# EasyEDA Pro project CH32V307_V1.0.0.eprj, board CH32V307
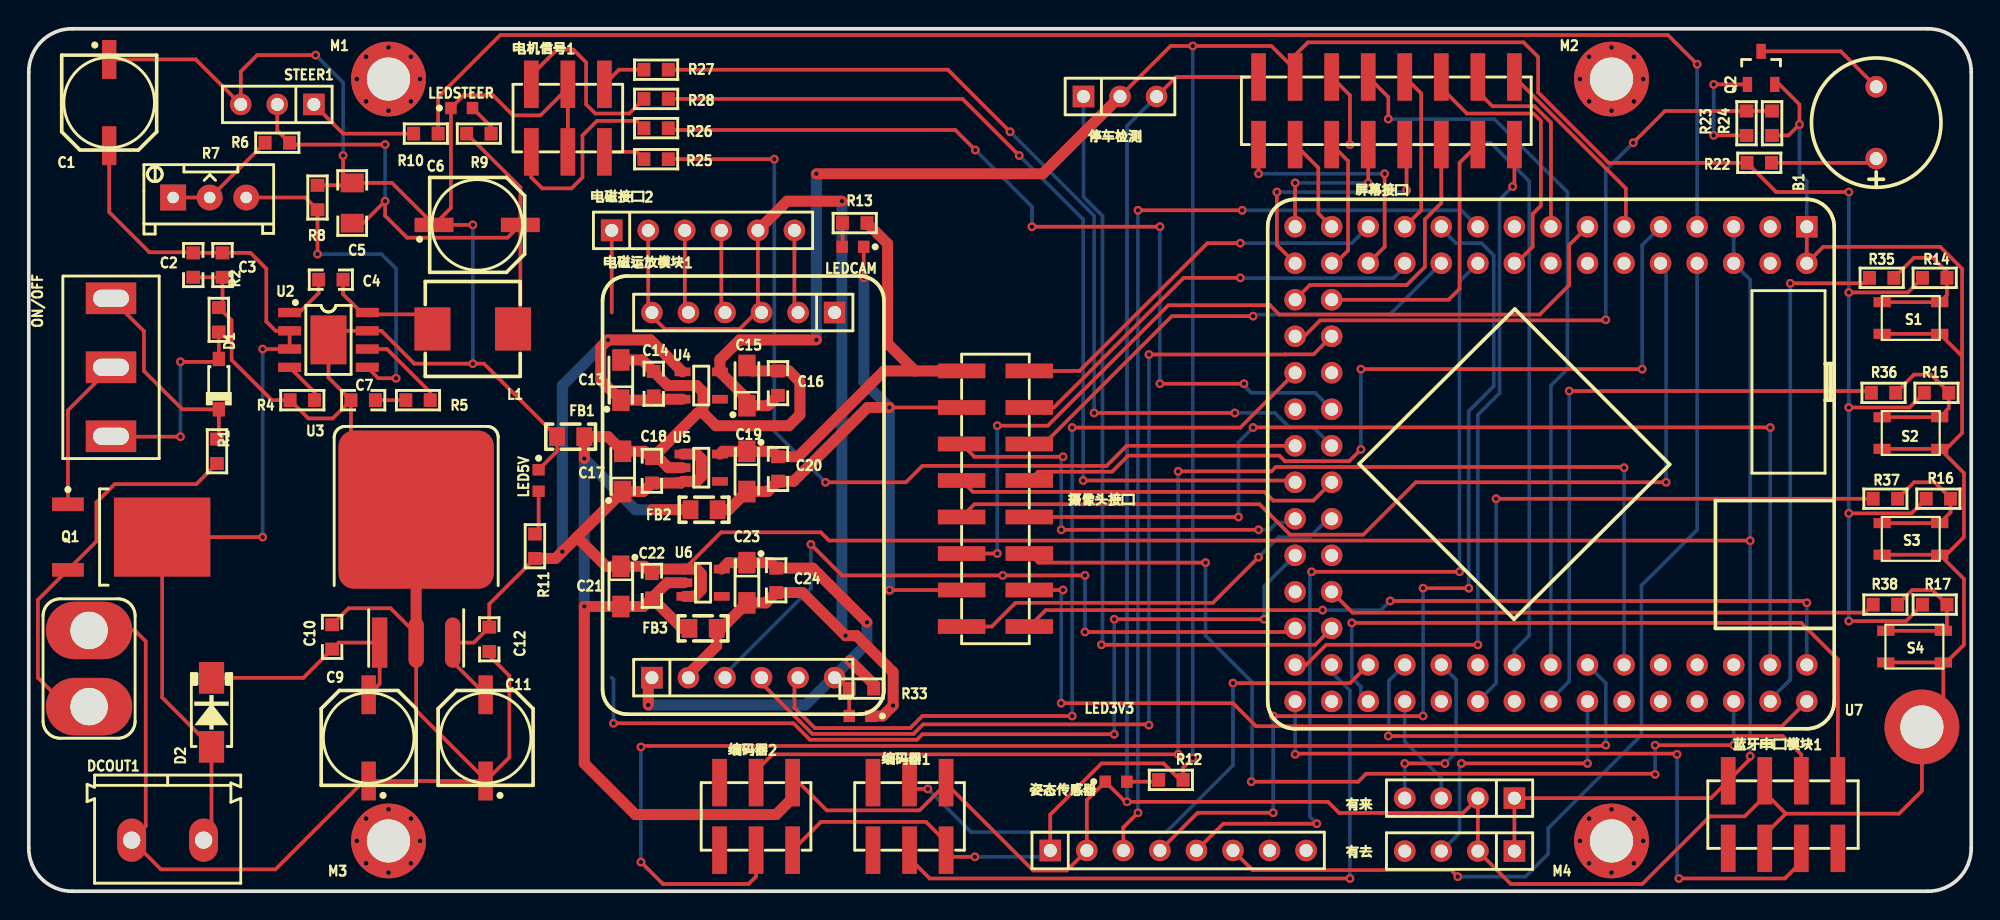
[diagram p1: board, top side]
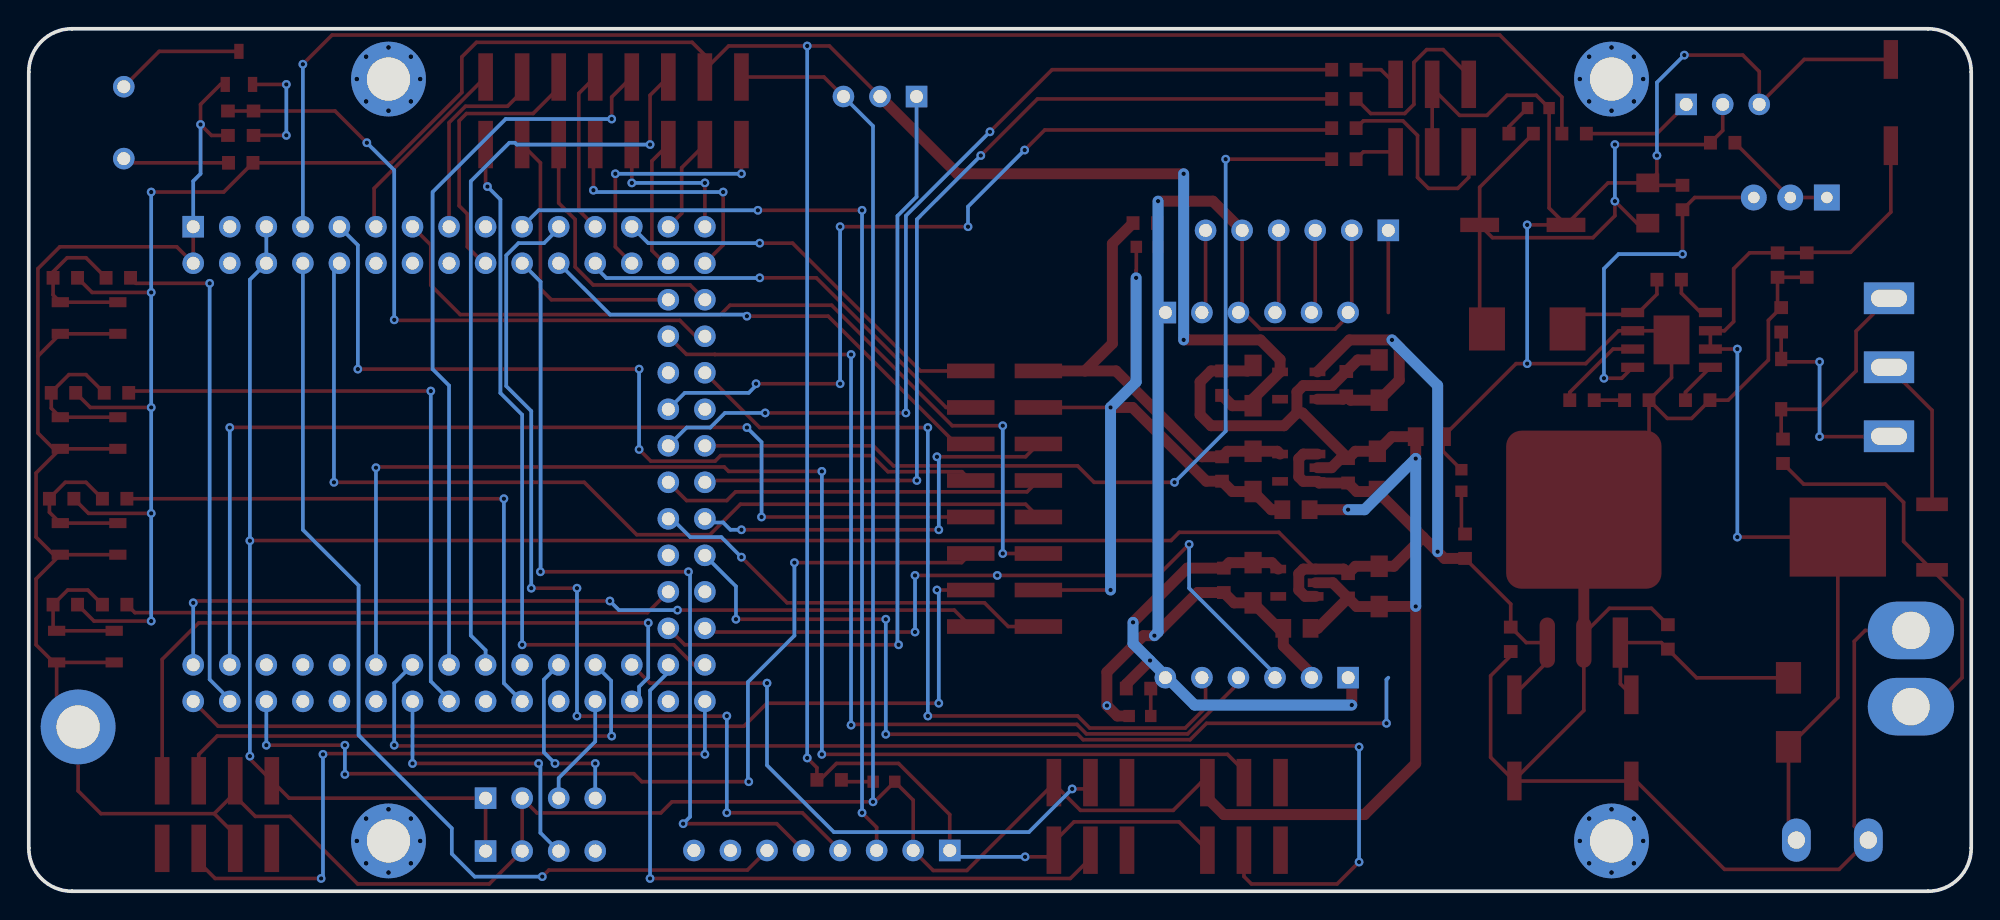
[diagram p2: board, bottom side, seen from below]

Outline 135 x 60 mm; copper layers: Top Layer, Bottom Layer. Coordinates in mm from the lower left corner of the outline.
Outline path: 0,57 0,3 arc(0.88,0.88) 3,0 132,0 arc(134.12,0.88) 135,3 135,57 arc(134.12,59.12) 132,60 3,60 arc(0.88,59.12) 0,57
Stack: Top Layer 0.035mm / Dielectric1 1.51mm FR4 er 4.5 / Bottom Layer 0.035mm

## Design rules (mm)
spacing safeClearance (default): track to track 0.152, other pairs 0.152 to 0.3
track width trackWidth (default): min 0.127, default 0.254, max 2.54
differential pair differentialPair (default): width min 0.127, default 0.254, max 2.54; gap min 0.152, default 0.152
via viaSize (default): diameter min 0.5, default 0.61, max 10; hole min 0.3, default 0.305, max 6

## Placement (name value [footprint] x y rotation side)
B1  BEEP  [BEEP 9x5.5mm]  128.4 53.47 90 top
C1  220uF  [CAPS6.3]  5.59 54.86 90 top
C2  4.7nF  [CAPC1608[0603]S-N]  11.43 43.56 270 top
C3  100nF  [CAPC1608[0603]S-N]  13.46 43.56 270 top
C4  100nF  [CAPC1608[0603]S-N]  20.99 42.55 0 top
C5  47uF  [CAPC3216[1206]S]  22.48 47.88 90 top
C6  220uF  [CAPS6.3]  31.16 46.36 180 top
C7  4.7nF  [CAPC1608[0603]S-N]  23.24 34.16 180 top
C9  100uF  [CAPS6.3]  23.62 10.67 270 top
C10  100nF  [CAPC1608[0603]S-N]  21.08 17.69 90 top
C11  220uF  [CAPS6.3]  31.75 10.67 270 top
C12  100nF  [CAPC1608[0603]S-N]  32 17.53 270 top
C13  10uF  [CAPT3216]  41.15 35.56 90 top
C14  100nF  [CAPC1608[0603]S-N]  43.43 35.31 90 top
C15  10uF  [CAPT3216]  49.91 35.18 90 top
C16  100nF  [CAPC1608[0603]S-N]  52.07 35.34 90 top
C17  10uF  [CAPT3216]  41.28 29.21 90 top
C18  100nF  [CAPC1608[0603]S-N]  43.31 29.25 90 top
C19  10uF  [CAPT3216]  49.91 29.21 270 top
C20  100nF  [CAPC1608[0603]S-N]  52.07 29.38 270 top
C21  10uF  [CAPT3216]  41.15 21.21 270 top
C22  100nF  [CAPC1608[0603]S-N]  43.31 21.25 270 top
C23  10uF  [CAPT3216]  49.91 21.46 270 top
C24  100nF  [CAPC1608[0603]S-N]  51.94 21.63 270 top
D1  BZT52C16  [SOD-123-L]  13.21 35.28 270 top
D2  SS54  [SMA[DO-214AC]]  12.7 12.45 90 top
DCOUT1  KF/WJ/DG 30x connecter  [KF/WJ/DG 301-2p-5.0mm]  9.65 3.56 0 top
FB1  0R  [INDC2012[0805]S]  37.66 31.62 0 top
FB2  0R  [INDC2012[0805]S]  46.93 26.54 0 top
FB3  0R  [INDC2012[0805]S]  46.86 18.29 0 top
L1  4.7uH  [0630 TPC 7*7*3]  30.86 39.12 0 top
LED3V3  翠绿贴片LED  [LEDC1608(0603)]  75.56 7.62 0 top
LED5V  翠绿贴片LED  [LEDC1608(0603)]  35.43 28.58 270 top
LEDCAM  翠绿贴片LED  [LEDC1608(0603)]  57.28 44.83 180 top
LEDOP  翠绿贴片LED  [LEDC1608(0603)]  57.77 12.19 180 top
LEDSTEER  翠绿贴片LED  [LEDC1608(0603)]  30.09 54.48 0 top
M1  MountHole  [M3-MountHole-Plated]  25 56.5 0 top
M2  MountHole  [M3-MountHole-Plated]  110 56.5 0 top
M3  MountHole  [M3-MountHole-Plated]  25 3.5 0 top
M4  MountHole  [M3-MountHole-Plated]  110 3.5 0 top
NOREF  -  [Pad_e1205]  131.57 11.43 0 top
ON/OFF  SW-SPDT  [SS12D10]  5.72 36.45 270 top
Q1  HY19P03  [TO-252AA]  6 24.64 0 top
Q2  S8050  [SOT-23]  120.4 57.28 90 top
R1  4.7K  [RESC1608[0603]S-N]  13.08 30.61 90 top
R2  1K  [RESC1608[0603]S-N]  13.21 39.75 270 top
R4  200K  [RESC1608[0603]S-N]  19.01 34.16 180 top
R5  20K  [RESC1608[0603]S-N]  27.05 34.16 180 top
R6  15K  [RESC1608[0603]S-N]  17.27 52.07 180 top
R7  10K  [RESPOT3296]  12.57 48.26 0 top
R8  3.3K  [RESC1608[0603]S-N]  20.07 48.26 90 top
R9  10K  [RESC1608[0603]S-N]  31.28 52.7 180 top
R10  1K  [RESC1608[0603]S-N]  27.6 52.7 0 top
R11  4.7K  [RESC1608[0603]S-N]  35.18 24 90 top
R12  2.7K  [RESC1608[0603]S-N]  79.38 7.75 180 top
R13  2.7K  [RESC1608[0603]S-N]  57.4 46.48 180 top
R14  4.7K(DNP)  [RESC1608[0603]S-N]  132.46 42.67 0 top
R15  4.7K(DNP)  [RESC1608[0603]S-N]  132.59 34.67 0 top
R16  4.7K(DNP)  [RESC1608[0603]S-N]  132.72 27.3 0 top
R17  4.7K(DNP)  [RESC1608[0603]S-N]  132.46 19.94 0 top
R22  10R  [RESC1608[0603]S-N]  120.27 50.67 0 top
R23  4.7K  [RESC1608[0603]S-N]  119.38 53.43 270 top
R24  10K  [RESC1608[0603]S-N]  121.16 53.43 270 top
R25  100R  [RESC1608[0603]S-N]  43.6 50.93 0 top
R26  100R  [RESC1608[0603]S-N]  43.6 53.09 0 top
R27  100R  [RESC1608[0603]S-N]  43.6 57.15 0 top
R28  100R  [RESC1608[0603]S-N]  43.6 55.12 0 top
R33  2.7K  [RESC1608[0603]S-N]  57.87 14.1 180 top
R35  470R  [RESC1608[0603]S-N]  128.78 42.67 180 top
R36  470R  [RESC1608[0603]S-N]  128.91 34.67 180 top
R37  470R  [RESC1608[0603]S-N]  129.03 27.3 180 top
R38  470R  [RESC1608[0603]S-N]  129.03 19.94 180 top
S1  Button  [PTS810-3*4-CurvePin]  130.81 39.88 0 top
S2  Button  [PTS810-3*4-CurvePin]  130.81 31.88 0 top
S3  Button  [PTS810-3*4-CurvePin]  130.81 24.51 0 top
S4  Button  [PTS810-3*4-CurvePin]  131.06 17.02 0 top
STEER1  Header 3  [HDR1X3]  19.81 54.74 180 top
U1  T型插头  [Wired T-Header ThroughHole]  4.19 15.49 180 top
U2  SCT2450  [SOP-8E]  20.83 38.35 0 top
U3  SPX2940-5.0  [TO-263-3]  26.92 21.92 0 top
U4  RT9013-33  [SOT-23-5]  46.74 35.18 0 top
U5  RT9013-33  [SOT-23-5]  46.74 29.46 0 top
U6  RT9013-33  [SOT-23-5]  46.86 21.46 0 top
U7  -  [CH32V307VxT6_CoreBoard]  123.57 46.23 180 top
停车检测  Header 3  [HDR1X3]  73.3 55.29 0 top
姿态传感器  Header 8  [HDR1X8]  70.99 2.84 0 top
屏幕接口  Header 8X2  [HDR2X8-M-SMT]  94.36 54.29 0 top
摄像头接口  Header 8X2  [HDR2X8-M-SMT]  67.18 27.3 90 top
有去  Header 4  [HDR1X4]  103.25 2.79 180 top
有来  Header 4  [HDR1X4]  103.25 6.48 180 top
电机信号1  Header 3X2  [HDR2X3-M-SMT]  37.47 53.78 0 top
电磁接口2  Header 6  [HDR1X6]  40.51 45.97 0 top
电磁运放模块1  OPA_MOD  [SEEKFREE_4CHANEL_OPAMOD]  49.66 27.56 0 top
编码器1  Header 3X2  [HDR2X3-M-SMT]  61.21 5.21 180 top
编码器2  Header 3X2  [HDR2X3-M-SMT]  50.55 5.21 180 top
蓝牙串口模块1  Header 4X2  [Female-Header-2.54-SMD-8]  121.92 5.33 270 top

## Footprints (pads in the part's own frame, mm; a bottom-side part is the same pattern mirrored in y, then rotated)
0630 TPC 7*7*3
  rect 2.5x3 smd: 1(-2.8,0) 2(2.8,0)
BEEP 9x5.5mm
  round 1.5 hole 0.9: 1(-2.5,0) 2(2.5,0)
CAPC1608[0603]S-N
  rect 0.9x0.95 smd: 1(-0.85,0) 2(0.85,0)
CAPC3216[1206]S
  rect 1.3x1.6 smd: 1(-1.4,0) 2(1.4,0)
CAPS6.3
  rect 2.7x1 smd: 1(-3,0) 2(3,0)
CAPT3216
  rect 1.5x1.2 smd: 1(-1.4,0) 2(1.4,0)
CH32V307VxT6_CoreBoard
  rect 1.5x1.5 hole 0.9: 1(0,0)
  round 1.5 hole 0.9: 2(0,2.54) 3(2.54,0) 4(2.54,2.54) 5(5.08,0) 6(5.08,2.54) 7(7.62,0) 8(7.62,2.54) 9(10.16,0) 10(10.16,2.54) 11(12.7,0) 12(12.7,2.54) 13(15.24,0) 14(15.24,2.54) 15(17.78,0) 16(17.78,2.54) 17(20.32,0) 18(20.32,2.54) 19(22.86,0) 20(22.86,2.54) 21(25.4,0) 22(25.4,2.54) 23(27.94,0) 24(27.94,2.54) 25(30.48,0) 26(30.48,2.54) 27(33.02,0) 28(33.02,2.54) 29(35.56,0) 30(35.56,2.54) 31(35.56,5.08) 32(33.02,5.08) 33(35.56,7.62) 34(33.02,7.62) 35(35.56,10.16) 36(33.02,10.16) 37(35.56,12.7) 38(33.02,12.7) 39(35.56,15.24) 40(33.02,15.24) 41(35.56,17.78) 42(33.02,17.78) 43(35.56,20.32) 44(33.02,20.32) 45(35.56,22.86) 46(33.02,22.86) 47(35.56,25.4) 48(33.02,25.4) 49(35.56,27.94) 50(33.02,27.94) 51(35.56,33.02) 52(35.56,30.48) 53(33.02,33.02) 54(33.02,30.48) 55(30.48,33.02) 56(30.48,30.48) 57(27.94,33.02) 58(27.94,30.48) 59(25.4,33.02) 60(25.4,30.48) 61(22.86,33.02) 62(22.86,30.48) 63(20.32,33.02) 64(20.32,30.48) 65(17.78,33.02) 66(17.78,30.48) 67(15.24,33.02) 68(15.24,30.48) 69(12.7,33.02) 70(12.7,30.48) 71(10.16,33.02) 72(10.16,30.48) 73(7.62,33.02) 74(7.62,30.48) 75(5.08,33.02) 76(5.08,30.48) 77(2.54,33.02) 78(2.54,30.48) 79(0,33.02) 80(0,30.48)
Female-Header-2.54-SMD-8
  rect 3.3x1.02 smd: 1(-2.35,3.81) 2(2.35,3.81) 3(-2.35,1.27) 4(2.35,1.27) 5(-2.35,-1.27) 6(2.35,-1.27) 7(-2.35,-3.81) 8(2.35,-3.81)
HDR1X3
  rect 1.5x1.5 hole 0.9: 1(0,0)
  round 1.5 hole 0.9: 2(2.54,0) 3(5.08,0)
HDR1X4
  rect 1.5x1.5 hole 0.9: 1(0,0)
  round 1.5 hole 0.9: 2(2.54,0) 3(5.08,0) 4(7.62,0)
HDR1X6
  rect 1.5x1.5 hole 0.9: 1(0,0)
  round 1.5 hole 0.9: 2(2.54,0) 3(5.08,0) 4(7.62,0) 5(10.16,0) 6(12.7,0)
HDR1X8
  rect 1.5x1.5 hole 0.9: 1(0,0)
  round 1.5 hole 0.9: 2(2.54,0) 3(5.08,0) 4(7.62,0) 5(10.16,0) 6(12.7,0) 7(15.24,0) 8(17.78,0)
HDR2X3-M-SMT
  rect 1.02x3.3 smd: 1(-2.54,-2.35) 2(-2.54,2.35) 3(0,-2.35) 4(0,2.35) 5(2.54,-2.35) 6(2.54,2.35)
HDR2X8-M-SMT
  rect 1.02x3.3 smd: 1(-8.89,-2.35) 2(-8.89,2.35) 3(-6.35,-2.35) 4(-6.35,2.35) 5(-3.81,-2.35) 6(-3.81,2.35) 7(-1.27,-2.35) 8(-1.27,2.35) 9(1.27,-2.35) 10(1.27,2.35) 11(3.81,-2.35) 12(3.81,2.35) 13(6.35,-2.35) 14(6.35,2.35) 15(8.89,-2.35) 16(8.89,2.35)
INDC2012[0805]S
  rect 1.1x1.3 smd: 1(-0.948,0) 2(0.948,0)
KF/WJ/DG 301-2p-5.0mm
  oval 2x3 hole 1.2: 1(2.5,0) 2(-2.5,0)
LEDC1608(0603)
  rect 0.8x0.85 smd: A(0.75,0) C(-0.75,0)
M3-MountHole-Plated
  round 5.2 hole 3: 1(0,0)
Pad_e1205
  round 5.2 hole 3: 1(0,0)
PTS810-3*4-CurvePin
  rect 1.2x0.7 smd: 1(-2,-1.1) 1(2,-1.1) 2(-2,1.1) 2(2,1.1)
RESC1608[0603]S-N
  rect 0.9x0.95 smd: 1(-0.85,0) 2(0.85,0)
RESPOT3296
  rect 1.8x1.8 hole 0.8: 1(-2.54,0)
  round 1.8 hole 0.8: 2(2.54,0) ADJ(0,0)
SEEKFREE_4CHANEL_OPAMOD
  rect 1.5x1.5 hole 0.9: 1(6.35,12.7) 7(-6.35,-12.7)
  round 1.5 hole 0.9: 2(3.81,12.7) 3(1.27,12.7) 4(-1.27,12.7) 5(-3.81,12.7) 6(-6.35,12.7) 8(-3.81,-12.7) 9(-1.27,-12.7) 10(1.27,-12.7) 11(3.81,-12.7) 12(6.35,-12.7)
SMA[DO-214AC]
  rect 2.2x1.75 smd: A(-2.4,0) K(2.4,0)
SOD-123-L
  rect 1x0.85 smd: A(-1.75,0) K(1.75,0)
SOP-8E
  rect 2.5x3.4 smd: 0(0,0)
  rect 1.6x0.65 smd: 1(-2.7,1.905) 2(-2.7,0.635) 3(-2.7,-0.635) 4(-2.7,-1.905) 5(2.7,-1.905) 6(2.7,-0.635) 7(2.7,0.635) 8(2.7,1.905)
SOT-23
  rect 1.05x0.65 smd: 1(-1.15,0.95) 2(-1.15,-0.95) 3(1.15,0)
SOT-23-5
  rect 1.1x0.6 smd: 1(-1.3,0.95) 2(-1.3,0) 3(-1.3,-0.95) 4(1.3,-0.95) 5(1.3,0.95)
SS12D10
  rect 2.2x3.5 hole 1.2x2.5: 1(-4.8,0) 2(0,0) 3(4.8,0)
TO-252AA
  rect 6.7x5.5 smd: 1(3.275,0)
  rect 2.2x0.95 smd: 2(-3.275,2.28) 3(-3.275,-2.28)
TO-263-3
  rect 1.07x3.5 smd: 1(-2.54,-4.623)
  rrect 10.8x11 smd: 2(0,4.623)
  rrect 1.07x3.5 smd: 2(0,-4.623) 3(2.54,-4.623)
Wired T-Header ThroughHole
  rrect 6x4 hole 2.6: 1(0,2.65) 2(0,-2.65)

## Nets
As in the schematic, except:
GND5V: C13.2 C14.2 C15.2 C16.2 C17.2 C18.2 C21.2 C22.2 FB1.2 FB2.1 FB3.1 LED3V3.C NOREF.1 Q2.2 R24.2 S1.1 S2.1 S3.1 S4.1 U4.2 U5.2 U6.2 U7.1 U7.2 停车检测.3 姿态传感器.2 屏幕接口.2 有去.2 有来.2 编码器1.1 编码器2.1 蓝牙串口模块1.5 蓝牙串口模块1.6

Pads without a net: M1 1; M2 1; M3 1; M4 1; U4 4; U5 4; U6 4; U7 3 4 12 14 16 17 36 37 46 47 53 59 62 63 69 71 72 73 74 76; 姿态传感器 7 8; 有去 4; 编码器1 5 6; 编码器2 5 6; 蓝牙串口模块1 2 8

## Via types
v1: diameter 0.61, hole 0.305, Top Layer to Bottom Layer, 203 vias

## Routing (per net, layer and track width the routed paths; a pad name or vN(x,y) marks a point on that pad's centre or on a via; arc(x,y) is an arc through that point)
GND5V: length 340.2
  Top Layer w0.254: S4.1 133.06,12.92 NOREF.1 131.57,6.98 129.98,5.4 122.11,5.4 ; S4.1 S4.1 ; S4.1 133.27,15.92 134.49,17.14 134.49,21.73 S3.1 ; 120.65,6.86 120.65,6.6 119.25,5.21 116.84,5.21 112.14,0.51 103,0.51 有去.2 有来.2 99.68,5.45 91.07,5.45 90.3,6.22 v1(76.33,6.22) 76.21,6.22 LED3V3.C 73.53,6.34 姿态传感器.2 72.14,1.44 69.8,1.44 63.75,7.49 ; 120.65,6.86 122.11,5.4 ; 120.65,6.86 蓝牙串口模块1.5 ; 63.75,7.49 63.75,7.47 61.91,5.63 55.46,5.63 53.53,7.56 编码器2.1 ; 63.75,7.49 编码器1.1 ; 停车检测.3 79.74,56.64 屏幕接口.2 ; S3.1 S3.1 ; S3.1 133.27,23.41 134.49,24.64 134.49,29.09 S2.1 ; 122.11,5.4 120.65,3.94 蓝牙串口模块1.6 ; S2.1 133.27,30.78 134.37,31.88 134.37,37.22 ; S2.1 S2.1 ; S1.1 S1.1 134.37,37.22 ; R24.2 122.3,52.58 v1(123.06,53.34) 123.06,54.74 121.67,56.13 Q2.2 ; 134.37,37.22 134.37,43.31 132.84,44.83 124.71,44.83 U7.2 U7.1
  Top Layer w0.762: 46.86,33.27 47.75,32.39 52.83,32.39 53.59,33.15 53.59,35.43 52.83,36.19 C16.2 50.29,36.19 49.91,36.58 ; 46.86,33.27 46.48,33.27 C18.2 ; 46.86,33.27 46.86,34.73 46.42,35.18 U4.2 44.41,35.18 C14.2 42.63,36.96 41.15,36.96 ; U5.2 44.45,29.46 43.82,30.1 C18.2 ; C18.2 42.8,30.61 C17.2 40.26,31.62 FB1.2 v1(38.61,30.1) ; v1(43.31,26.54) FB2.1 ; C22.2 44.37,21.46 U6.2 ; C22.2 45.42,18.29 FB3.1 ; C22.2 42.72,19.81 C21.2 41.14,19.81 v1(38.61,19.81) 38.61,8.89 42.16,5.33 51.94,5.33 53.09,6.48 编码器2.1
  Bottom Layer w0.254: U7.1 123.57,49.4 123.06,49.91 v1(123.06,53.34) ; v1(76.33,6.22) 76.33,53.23 停车检测.3
  Bottom Layer w0.762: v1(38.61,19.81) v1(38.61,30.1) 42.16,26.54 v1(43.31,26.54)
GNDBAT: length 213
  Top Layer w0.254: U3.2 26.92,12.57 31.75,7.75 C11.2 ; v1(21.84,51.18) 21.84,49.91 22.48,49.28 ; U3.2 22.39,31.08 C7.2 ; C7.2 21.12,32.89 19.43,32.89 R4.2 16.89,34.16 14.1,36.96 14.1,39.71 R2.1 13.46,40.86 C3.2 C2.2 ; C7.2 20.83,35.73 U2.0 21.46,38.99 U2.7 24.51,38.99 26.79,36.7 v1(30.86,36.7) 31.63,36.7 FB1.1 36.71,30.61 LED5V.C ; R8.2 22.31,49.11 22.48,49.28 ; U1.2 7.37,18.14 8.13,17.39 8.13,4.53 DCOUT1.2 9.18,1.52 17.14,1.52 23.29,7.67 C9.2 C11.2 ; 37.47,55.88 电机信号1.4 ; 37.47,55.88 35.56,53.97 33.66,53.97 32.26,55.37 30.23,55.37 LEDSTEER.C 29.34,47.53 C6.2 ; 37.47,55.88 电机信号1.3 ; 26.92,17.91 25.15,19.69 22.22,19.69 21.08,18.54 ; 22.48,49.28 25.24,49.28 C6.2 ; v1(19.94,58.17) 15.88,58.17 14.73,57.02 STEER1.3 11.61,57.86 C1.2 ; C11.2 33.4,9.32 33.4,14.99 32,16.38 C12.2 ; v1(30.86,46.36) C6.2
  Top Layer w0.762: U3.2 U3.2
  Bottom Layer w0.254: v1(19.94,58.17) 21.84,56.26 v1(21.84,51.18) ; v1(30.86,36.7) v1(30.86,46.36)
GNDCAM: length 49.5
  Top Layer w0.254: v1(59.82,20.95) 摄像头接口.4 ; v1(59.82,33.66) 摄像头接口.14 ; v1(58.04,42.67) 58.04,43.18 58.03,43.19 LEDCAM.C
  Top Layer w0.762: v1(59.82,33.66) 58.29,33.66 53.16,28.53 C20.2 51.35,27.81 C19.2 48.65,26.54 FB2.2
  Bottom Layer w0.762: v1(59.82,20.95) v1(59.82,33.66) 58.04,35.43 v1(58.04,42.67)
GNDOP: length 81.1
  Top Layer w0.254: 电磁接口2.5 50.67,40.26 50.55,40.26 49.4,39.12 44.2,39.12 43.05,40.26 电磁接口2.2
  Top Layer w0.762: 电磁接口2.5 52.71,48.01 v1(56.51,48.01) ; LEDOP.C 59.35,12.19 v1(60.07,12.92) 60.07,15.24 57.53,17.78 v1(56.77,17.78) 53.77,20.78 C24.2 51.22,20.06 C23.2 48.14,18.29 FB3.2 47.81,17.08 45.59,14.86
  Bottom Layer w0.762: v1(56.77,17.78) 56.51,18.03 v1(56.51,48.01)
VCC3V3: length 246.7
  Top Layer w0.254: v1(126.49,48.64) 121.45,48.64 R22.1 109.8,50.67 104.9,55.57 104.9,58.04 103.89,59.05 88.9,59.05 88.01,58.17 88.01,57.15 ; v1(126.49,33.66) 130.72,33.66 R15.1 ; v1(126.49,41.66) 130.59,41.66 131.61,42.67 ; 88.01,57.15 屏幕接口.4 ; 88.01,57.15 86.36,58.8 v1(80.9,58.8) 79.36,58.8 75.84,55.29 ; v1(80.9,9.27) 80.22,8.6 R12.1 80.01,7.75 78.87,8.89 74.55,8.89 70.99,5.33 姿态传感器.1 ; 131.61,19.94 130.47,18.8 v1(126.49,18.8) ; R16.1 130.85,26.29 v1(126.49,26.29) ; 编码器2.2 55.06,4.83 62.36,4.83 63.75,3.43 编码器1.2 64.22,2.4 v1(65.76,2.4)
  Top Layer w0.762: 75.84,55.29 70.47,49.91 v1(54.74,49.91) ; v1(54.74,38.35) 49.4,38.35 48.04,36.99 U4.5 49.91,34.25 C15.1 51.35,33.78 C16.1
  Bottom Layer w0.254: 姿态传感器.1 70.55,2.4 v1(65.76,2.4) ; v1(80.9,58.8) v1(80.9,9.27) ; v1(126.49,18.8) v1(126.49,33.66) v1(126.49,41.66) v1(126.49,48.64)
  Bottom Layer w0.762: v1(54.74,49.91) v1(54.74,38.35)
VCC5V: length 208.5
  Top Layer w0.254: C11.1 29.46,15.95 U3.3 30.92,17.3 C12.1 32,19.98 R11.1 ; v1(119.63,24.38) 119.62,24.4 55.61,24.4 55.04,24.97 48.12,24.97 U6.1 ; v1(119.63,9.4) 119.63,9.21 蓝牙串口模块1.7 116.9,6.48 有来.1 有去.1
  Top Layer w0.762: 37.04,23.58 36.61,23.15 R11.1 ; 37.04,23.58 v1(37.08,23.62) ; 37.04,23.58 38.1,24.63 ; U4.1 43.21,38.35 v1(40.26,38.35) 39.75,37.85 39.75,35.56 C13.1 43.14,34.16 C14.1 43.66,34.23 U4.3 ; U5.1 46.42,30.41 46.74,30.1 46.74,28.83 46.42,28.51 U5.3 45.32,28.4 C18.1 42.72,27.81 C17.1 38.1,24.63 ; 38.1,24.63 40.13,22.61 C21.1 42.8,22.61 C22.1 43.62,22.41 U6.1 46.42,22.41 46.74,22.09 46.74,20.95 46.29,20.51 U6.3
  Bottom Layer w0.254: v1(119.63,9.4) v1(119.63,24.38) 119.63,42.55 U7.6 U7.5
  Bottom Layer w0.762: v1(37.08,23.62) 37.08,35.18 v1(40.26,38.35)
VCCBAT: length 68.7
  Top Layer w0.254: v1(16.26,37.72) U2.3 U2.2 17.15,38.99 16.51,39.63 16.51,43.31 15.41,44.41 C3.1 C2.1 11.39,44.45 8.38,44.45 5.59,47.24 C1.1 ; v1(16.26,24.64) Q1.1 9.27,13.47 D2.A 12.7,4.1 DCOUT1.1
  Bottom Layer w0.254: v1(16.26,37.72) v1(16.26,24.64)
VCCCAM: length 31.2
  Top Layer w0.762: 61.59,36.19 59.44,36.19 53.47,30.23 C20.1 51.69,30.61 C19.1 48.23,30.61 U5.5 ; 61.59,36.19 59.69,38.1 59.69,45.05 R13.1 ; 61.59,36.19 摄像头接口.16
VCCOP: length 35
  Top Layer w0.762: R33.1 58.72,14.4 v1(57.07,16.05) ; U6.5 48.61,22.86 C23.1 51.56,22.86 C24.1 54.48,22.48 v1(58.25,18.71) ; 43.05,14.86 v1(43.05,12.95)
  Bottom Layer w0.762: v1(58.25,18.71) 58.25,17.23 v1(57.07,16.05) 53.97,12.95 v1(43.05,12.95)
VCCSTEER: length 43.3
  Top Layer w0.254: C5.1 23.23,46.48 v1(24.77,48.01) 24.77,46.99 26.29,45.47 33.27,45.47 C6.1 ; C6.1 34.16,39.62 L1.2 ; C6.1 34.16,48.97 30.43,52.7 ; STEER1.2 17.27,52.92 R6.1 18.25,51.94 v1(24.77,51.94)
  Bottom Layer w0.254: v1(24.77,51.94) v1(24.77,48.01)
(no net):
  vias: v1(22.8,56.5) v1(22.8,56.5) v1(22.8,3.5) v1(22.8,3.5) v1(23.44,58.06) v1(23.44,58.06) v1(23.44,54.94) v1(23.44,54.94) v1(23.44,5.06) v1(23.44,5.06) v1(23.44,1.94) v1(23.44,1.94) v1(25,58.7) v1(25,58.7) v1(25,54.3) v1(25,54.3) v1(25,5.7) v1(25,5.7) v1(25,1.3) v1(25,1.3) v1(26.56,58.06) v1(26.56,58.06) v1(26.56,54.94) v1(26.56,54.94) v1(26.56,5.06) v1(26.56,5.06) v1(26.56,1.94) v1(26.56,1.94) v1(27.2,56.5) v1(27.2,56.5) v1(27.2,3.5) v1(27.2,3.5) v1(107.8,56.5) v1(107.8,56.5) v1(107.8,3.5) v1(107.8,3.5) v1(108.44,58.06) v1(108.44,58.06) v1(108.44,54.94) v1(108.44,54.94) v1(108.44,5.06) v1(108.44,5.06) v1(108.44,1.94) v1(108.44,1.94) v1(110,58.7) v1(110,58.7) v1(110,54.3) v1(110,54.3) v1(110,5.7) v1(110,5.7) v1(110,1.3) v1(110,1.3) v1(111.56,58.06) v1(111.56,58.06) v1(111.56,54.94) v1(111.56,54.94) v1(111.56,5.06) v1(111.56,5.06) v1(111.56,1.94) v1(111.56,1.94) v1(112.2,56.5) v1(112.2,56.5) v1(112.2,3.5) v1(112.2,3.5)
A0: length 61.5
  Top Layer w0.254: v1(65.79,51.56) 64.39,52.96 44.58,52.96 R26.2 ; v1(69.72,46.23) v1(78.61,46.23) ; v1(78.61,35.31) v1(84.46,35.31)
  Bottom Layer w0.254: v1(65.79,51.56) 69.72,47.62 v1(69.72,46.23) ; U7.38 89.41,34.67 84.96,34.67 84.46,35.18 v1(84.46,35.31) ; v1(78.61,46.23) v1(78.61,35.31)
A1: length 65
  Top Layer w0.254: v1(51.82,50.93) R25.2 ; U7.39 76.3,30.99 74.91,29.59 62.1,29.59 60.96,28.45 v1(55.37,28.45)
  Bottom Layer w0.254: v1(51.82,50.93) 51.82,32 v1(55.37,28.45)
A2: length 65
  Top Layer w0.254: v1(83.82,33.27) v1(74.04,33.27) ; v1(68.2,52.83) 63.88,57.15 R27.2
  Bottom Layer w0.254: U7.40 89.28,32.26 87.63,32.26 86.61,33.27 v1(83.82,33.27) ; v1(68.2,52.83) 74.04,46.99 v1(74.04,33.27)
A3: length 65.2
  Top Layer w0.254: R28.2 64.9,55.12 v1(68.83,51.18) ; U7.41 87.88,28.58 v1(73.28,28.58)
  Bottom Layer w0.254: v1(73.28,28.58) 73.28,46.74 v1(68.83,51.18)
A4: length 26.8
  Top Layer w0.254: 摄像头接口.10 65.62,27.79 85.88,27.79 86.49,27.18 89.28,27.18 U7.42
A5: length 29.1
  Top Layer w0.254: v1(71.88,30.23) 65.72,30.23 摄像头接口.12 ; v1(85.47,25.15) v1(71.75,25.15)
  Bottom Layer w0.254: v1(71.75,25.15) 71.75,30.1 v1(71.88,30.23) ; U7.43 87.76,25.65 86.74,25.65 86.23,25.15 v1(85.47,25.15)
A6: length 28.8
  Top Layer w0.254: 摄像头接口.2 66.93,18.41 68.58,20.07 82.3,20.07 v1(85.47,23.24)
  Bottom Layer w0.254: U7.44 90.3,25.91 89.03,24.64 86.87,24.64 v1(85.47,23.24)
A7: length 62.4
  Top Layer w0.254: v1(85.85,18.92) v1(75.44,18.92) ; v1(75.44,10.92) 62.1,10.92 61.72,10.54 54.29,10.54 53.15,11.68 v1(40.64,11.68)
  Bottom Layer w0.254: v1(40.64,11.68) 40.64,14.73 40.51,14.86 ; v1(85.85,18.92) 85.85,21.21 U7.45 ; v1(75.44,18.92) v1(75.44,10.92)
A8: length 35.3
  Top Layer w0.254: R35.2 127.55,42.29 v1(122.43,42.29)
  Bottom Layer w0.254: U7.77 121.03,13.33 122.43,14.73 v1(122.43,42.29)
A9: length 59.1
  Top Layer w0.254: v1(89.92,19.56) 70.68,19.56 摄像头接口.1 ; v1(94.62,20.19) 123.44,20.19 v1(123.57,20.07)
  Bottom Layer w0.254: v1(89.92,19.56) 93.98,19.56 v1(94.62,20.19) ; v1(123.57,20.07) U7.80
A10: length 63.5
  Top Layer w0.254: v1(71.75,13.08) 83.69,13.08 85.29,11.48 121.84,11.48 U7.79 ; v1(71.88,20.95) 摄像头接口.3
  Bottom Layer w0.254: v1(71.88,20.95) 71.75,20.83 v1(71.75,13.08)
A15: length 104
  Top Layer w0.254: R10.2 28.45,55.25 32.77,59.56 113.92,59.56 v1(115.95,57.53)
  Bottom Layer w0.254: v1(115.95,57.53) U7.7
B0: length 38.5
  Top Layer w0.254: U7.48 92,19.38 127.62,19.38 R38.2
B1: length 50.4
  Top Layer w0.254: v1(54.36,24.13) 56.51,21.97 v1(67.69,21.97) v1(73.41,21.97) ; v1(73.41,18.03) 87.4,18.03 87.65,18.29 U7.49
  Bottom Layer w0.254: v1(54.36,24.13) 54.36,21.08 48.13,14.86 ; v1(73.41,18.03) v1(73.41,21.97)
B2: length 55.2
  Top Layer w0.254: U7.50 89.41,17.14 v1(74.55,17.14)
  Bottom Layer w0.254: 停车检测.1 73.3,48.3 74.62,46.98 74.62,17.22 v1(74.55,17.14)
B3: length 69.1
  Top Layer w0.254: v1(77.09,5.46) 76.07,4.44 姿态传感器.3 ; v1(77.09,47.37) v1(84.33,47.37)
  Bottom Layer w0.254: U7.19 99.57,47.37 v1(84.33,47.37) ; v1(77.09,47.37) v1(77.09,5.46)
B4: length 59.2
  Top Layer w0.254: v1(89.52,4.7) 83.02,4.7 姿态传感器.5 ; v1(89.15,22.22) v1(99.44,22.22)
  Bottom Layer w0.254: v1(99.44,22.22) 99.43,22.24 99.43,42.41 U7.20 ; v1(89.15,22.22) 89.04,22.11 89.04,5.18 v1(89.52,4.7)
B5: length 66.6
  Top Layer w0.254: 姿态传感器.4 81.24,5.46 v1(86.49,5.46) ; v1(96.9,21.08) v1(100.08,21.08) ; v1(86.49,12.19) 86.5,12.18 96.89,12.18 v1(96.9,12.19)
  Bottom Layer w0.254: v1(86.49,12.19) v1(86.49,5.46) ; U7.21 98.17,46.1 99.19,45.08 100.97,45.08 101.81,44.23 101.81,35.14 100.08,33.4 v1(100.08,21.08) ; v1(96.9,21.08) v1(96.9,12.19)
B6: length 33.8
  Top Layer w0.254: 摄像头接口.11 70.55,31.11 79.44,40 v1(85.09,40)
  Bottom Layer w0.254: U7.22 94.6,40.12 85.2,40.12 v1(85.09,40)
B7: length 11.4
  Top Layer w0.254: U7.23 96.77,47.37 96.77,55.5 屏幕接口.10
B8: length 30.4
  Top Layer w0.254: v1(84.2,42.67) 80.26,42.67 71.25,33.66 摄像头接口.13
  Bottom Layer w0.254: v1(84.2,42.67) 84.21,42.66 94.86,42.66 95.63,43.43 U7.24
B9: length 27.7
  Top Layer w0.254: 摄像头接口.15 73.03,36.19 81.91,45.08 v1(84.2,45.08)
  Bottom Layer w0.254: U7.25 91.95,45.08 v1(84.2,45.08)
B12: length 40.8
  Top Layer w0.254: v1(101.98,27.3) R37.2
  Bottom Layer w0.254: v1(101.98,27.3) 101.98,14.48 U7.61
B13: length 52.9
  Top Layer w0.254: v1(91.82,51.94) 91.82,55.37 屏幕接口.6
  Bottom Layer w0.254: U7.64 103.25,16.76 104.28,17.79 104.28,49.39 101.6,52.07 101.22,52.07 101.09,51.94 v1(91.82,51.94)
B15: length 51.4
  Top Layer w0.254: v1(94.49,53.72) 94.49,55.25 屏幕接口.8
  Bottom Layer w0.254: v1(94.49,53.72) 101.85,53.72 106.93,48.64 106.93,36.32 105.79,35.18 U7.66
C0: length 68.2
  Top Layer w0.254: v1(77.85,11.56) 77.8,11.61 62.15,11.61 61.49,10.95 54.46,10.95 50.67,14.73 50.67,14.86 ; U7.34 89.29,37.35 87.32,37.35 87.31,37.34 v1(77.85,37.34)
  Bottom Layer w0.254: v1(77.85,37.34) v1(77.85,11.56)
C1: length 59.5
  Top Layer w0.254: 53.21,14.86 53.21,12.77 54.63,11.35 61.26,11.35 62.1,12.19 v1(72.52,12.19) ; U7.35 84.2,32.26 v1(72.52,32.26)
  Bottom Layer w0.254: v1(72.52,12.19) v1(72.52,32.26)
C8: length 68
  Top Layer w0.254: v1(113.03,8.13) 112.98,8.18 92.95,8.18 92.39,7.62 v1(84.96,7.62) ; v1(81.79,22.86) 70.17,22.86 摄像头接口.5 ; v1(113.03,10.16) v1(118.49,10.16)
  Bottom Layer w0.254: v1(81.79,22.86) 81.79,17.78 85.02,14.55 85.02,7.63 85.01,7.62 v1(84.96,7.62) ; v1(113.03,10.16) v1(113.03,8.13) ; v1(118.49,10.16) U7.75
C9: length 73.6
  Top Layer w0.254: v1(85.09,32.26) 85.1,32.27 121.02,32.27 v1(121.03,32.26) ; v1(84.07,26.03) 摄像头接口.7
  Bottom Layer w0.254: v1(121.03,32.26) U7.78 ; v1(85.09,32.26) 84.07,31.24 v1(84.07,26.03)
C10: length 68.7
  Top Layer w0.254: v1(99.31,1.02) 98.86,1.47 85.06,1.47 83.69,2.84
  Bottom Layer w0.254: U7.8 115.95,25.15 112.08,21.27 112.08,10.86 105.6,4.38 105.6,2.6 104.01,1.02 v1(99.31,1.02)
C11: length 59.8
  Top Layer w0.254: 摄像头接口.9 70.14,29.18 75.29,29.18 76.4,30.3 86.92,30.3 87.3,29.92 91.77,29.92 v1(92.58,30.73) ; v1(92.58,36.32) v1(112.13,36.32)
  Bottom Layer w0.254: U7.9 112.13,44.95 v1(112.13,36.32) ; v1(92.58,30.73) v1(92.58,36.32)
C12: length 67.1
  Top Layer w0.254: 摄像头接口.8 65.72,26.92 85.54,26.92 87.66,24.8 92.75,24.8 96.39,28.45 v1(113.79,28.45)
  Bottom Layer w0.254: v1(113.79,28.45) 113.79,43.31 U7.10
C13: length 45.7
  Top Layer w0.254: U7.33 88.65,38.61 89.75,39.71 109.56,39.71 v1(109.6,39.75) ; R24.1 R23.1 113.71,54.28 v1(111.51,52.07)
  Bottom Layer w0.254: v1(111.51,52.07) 109.6,50.16 v1(109.6,39.75)
D0: length 13.7
  Top Layer w0.254: U7.11 111,46.36 111,48.9 屏幕接口.16
D2: length 60.3
  Top Layer w0.254: U7.13 107.06,44.96 107.06,42.16 105.02,40.12 86.91,40.12 86.27,40.77 79.2,40.77 70.82,32.39 v1(67.31,32.39) ; v1(67.31,23.5) 摄像头接口.6
  Bottom Layer w0.254: v1(67.31,32.39) v1(67.31,23.5)
D4: length 14.2
  Top Layer w0.254: 屏幕接口.14 100.71,55.63 101.73,54.61 104.65,54.61 105.79,53.47 U7.15
D7: length 19.4
  Top Layer w0.254: U7.18 103.38,43.69 104.52,44.83 104.52,47.12 105.09,47.69 105.09,53.59 104.58,54.1 99.95,54.1 98.17,55.88 屏幕接口.12
D8: length 43.2
  Top Layer w0.254: v1(107.06,34.8) 127.93,34.8 R36.2
  Bottom Layer w0.254: v1(107.06,34.8) 107.06,14.61 105.79,13.33 U7.65
D9: length 91.9
  Top Layer w0.254: v1(42.54,2.03) 44.07,0.51 50.03,0.51 50.55,1.03 编码器2.4 ; v1(109.6,10.16) 109.55,10.11 42.62,10.11 v1(42.54,10.03)
  Bottom Layer w0.254: v1(42.54,2.03) v1(42.54,10.03) ; v1(109.6,10.16) 109.6,14.48 U7.68
D10: length 19.8
  Top Layer w0.254: v1(99.57,8.89) v1(108.33,8.89)
  Bottom Layer w0.254: 有去.3 99.44,4.06 99.44,8.76 v1(99.57,8.89) ; v1(108.33,8.89) U7.67
D11: length 95.2
  Top Layer w0.254: 编码器2.3 50.55,8.38 51.69,9.53 v1(79.88,9.53) ; v1(79.88,29.21) 86.36,29.21 86.66,29.52 110.82,29.52 v1(110.87,29.46)
  Bottom Layer w0.254: v1(110.87,29.46) U7.70 ; v1(79.88,29.21) v1(79.88,9.53)
E0: length 17.5
  Top Layer w0.254: v1(85.47,49.91) 屏幕接口.1 ; v1(94.23,49.91) 94.23,44.83 U7.26
  Bottom Layer w0.254: v1(94.23,49.91) v1(85.47,49.91)
E1: length 6.8
  Top Layer w0.254: 屏幕接口.3 89.62,50.33 89.62,47.16 U7.27
E2: length 9.4
  Top Layer w0.254: 屏幕接口.5 91.69,50.8 91.69,44.58 90.81,43.69 U7.28
E3: length 10.8
  Top Layer w0.254: v1(88.01,49.28) U7.29 ; v1(93.09,49.28) 屏幕接口.7
  Bottom Layer w0.254: v1(93.09,49.28) v1(88.01,49.28)
E4: length 17.8
  Top Layer w0.254: U7.30 86.74,44.96 v1(86.74,48.64) ; v1(95.76,48.77) 95.76,51.82 屏幕接口.9
  Bottom Layer w0.254: v1(86.74,48.64) 95.63,48.64 v1(95.76,48.77)
E5: length 18.9
  Top Layer w0.254: U7.31 89.04,42.18 95.77,42.18 97.03,43.43 97.03,46.74 98.17,47.88 屏幕接口.11
E6: length 19.8
  Top Layer w0.254: U7.32 98.68,41.15 99.44,41.91 99.44,50.67 屏幕接口.13
E7: length 49.1
  Top Layer w0.254: 屏幕接口.15 103.25,49.15 v1(103.12,49.02) ; U7.52 88.77,15.75 90.17,17.14 v1(100.71,17.14)
  Bottom Layer w0.254: v1(100.71,17.14) 100.71,33.15 102.22,34.66 102.22,48.12 v1(103.12,49.02)
E8: length 48.9
  Top Layer w0.254: v1(88.01,9.53) 88.06,9.58 114.5,9.58 v1(114.55,9.53) ; 蓝牙串口模块1.4 123.19,2.03 122.05,0.89 v1(114.68,0.89)
  Bottom Layer w0.254: v1(114.55,9.53) 114.55,1.02 v1(114.68,0.89) ; v1(88.01,9.53) U7.51
E9: length 47.1
  Top Layer w0.254: v1(91.82,0.89) 62.61,0.89 61.21,2.29 编码器1.4
  Bottom Layer w0.254: v1(91.82,0.89) 91.82,13.97 90.55,15.24 U7.54
E11: length 41.5
  Top Layer w0.254: v1(62.48,7.12) 61.65,7.12 编码器1.3 ; v1(83.69,14.48) 91.82,14.48 U7.56
  Bottom Layer w0.254: v1(83.69,14.48) 83.69,8.76 79.04,4.11 65.49,4.11 v1(62.48,7.12)
E12: length 49.5
  Top Layer w0.254: 蓝牙串口模块1.1 125.73,16.13 123.19,18.67 v1(91.95,18.67)
  Bottom Layer w0.254: U7.55 92.58,13.21 92.58,14.22 91.95,14.86 v1(91.95,18.67)
E13: length 36.5
  Top Layer w0.254: 蓝牙串口模块1.3 123.19,9.51 121.91,10.8 v1(94.49,10.8)
  Bottom Layer w0.254: v1(94.49,10.8) 94.53,10.83 94.53,14.64 U7.58
E14: length 7.8
  Bottom Layer w0.254: U7.57 95.63,10.41 98.17,7.87 有来.3
E15: length 12.8
  Top Layer w0.254: v1(98.43,8.89) v1(95.63,8.89)
  Bottom Layer w0.254: U7.60 99.2,14.72 99.2,9.67 v1(98.43,8.89) ; v1(95.63,8.89) 有来.4
$1N1646: length 27.8
  Top Layer w0.254: R1.1 11.64,28.32 5.97,28.32 4.7,27.05 4.7,24.34 0.64,20.27 0.64,14.86 2.65,12.84 U1.1
$1N1675: length 14.7
  Top Layer w0.254: ON/OFF.3 5.74,31.62 v1(10.54,31.62) ; v1(10.54,36.83) 13.01,36.83 D1.A R2.2
  Bottom Layer w0.254: v1(10.54,36.83) v1(10.54,31.62)
$1N1680: length 14.4
  Top Layer w0.254: R1.2 13.21,31.58 D1.K 10.67,33.53 8,36.19 8,38.96 ON/OFF.1
$1N4031: length 2.3
  Top Layer w0.254: R12.2 78.4,7.62 LED3V3.A
$1N14893: length 1.7
  Top Layer w0.254: LEDCAM.A 56.55,44.86 R13.2
$1N15943: length 16.6
  Top Layer w0.254: C9.1 24.38,14.43 U3.1 21.54,17.3 C10.1 19.09,14.85 D2.K
$1N17858: length 3.1
  Top Layer w0.254: R11.2 35.43,25.11 LED5V.A
$1N22991: length 1.9
  Top Layer w0.254: R33.2 LEDOP.A
$1N30175: length 10.8
  Top Layer w0.254: 2.72,26.92 2.72,33.45 ON/OFF.2
$1N38666: length 3
  Top Layer w0.254: 19.86,34.16 19.86,34.72 U2.4
$1N39173: length 3.5
  Top Layer w0.254: C4.1 20.14,41.61 18.8,40.26 U2.1
$1N39467: length 8.2
  Top Layer w0.254: L1.1 27.04,40.13 23.66,40.13 U2.8 23.11,40.26 21.84,41.53 C4.2
$1N41387: length 8
  Top Layer w0.254: R6.2 12.61,48.26 R7.ADJ 10.03,48.26
$1N41664: length 6.2
  Top Layer w0.254: R5.1 27.9,34.71 24.89,37.72 U2.6
$1N41948: length 2.1
  Top Layer w0.254: R5.2 C7.1
$1N42725: length 24.2
  Top Layer w0.254: U2.5 24.29,35.69 v1(25.53,35.69) ; R7.2 19.22,48.26 R8.1 v1(20.07,44.32)
  Bottom Layer w0.254: v1(20.07,44.32) 24.51,44.32 25.53,43.31 v1(25.53,35.69)
$1N43649: length 2.3
  Top Layer w0.254: R9.1 32.13,53.19 LEDSTEER.A
$1N45499: length 7.8
  Top Layer w0.254: STEER1.1 21.84,52.7 R10.1
$1N56324: length 11
  Top Layer w0.254: S1.2 S1.2 133.31,41.48 R14.2 133.31,43.09 132.33,44.07 131.03,44.07 R35.1
$1N56387: length 10.7
  Top Layer w0.254: S2.2 S2.2 133.44,33.61 R15.2 133.44,34.71 132.21,35.94 131.03,35.94 R36.1
$1N56450: length 10.7
  Top Layer w0.254: S3.2 S3.2 133.56,26.37 R16.2 133.56,27.34 132.46,28.45 131.03,28.45 R37.1
$1N56513: length 10.2
  Top Layer w0.254: R38.1 130.9,20.95 132.29,20.95 R17.2 133.31,18.36 S4.2 S4.2
$1N101481: length 7.4
  Top Layer w0.254: B1.1 128.1,50.67 R22.2
$1N101720: length 9
  Top Layer w0.254: B1.2 125.94,58.43 Q2.3
$1N102266: length 8.2
  Top Layer w0.254: R23.2 119.37,52.58 v1(117.1,52.58) ; Q2.1 v1(117.1,56.13)
  Bottom Layer w0.254: v1(117.1,56.13) v1(117.1,52.58) 117.09,52.58
$1N103802: length 3
  Top Layer w0.254: 电机信号1.5 42.24,51.44 R25.1
$1N103804: length 13.8
  Top Layer w0.254: 电机信号1.1 34.92,49.66 35.69,48.89 37.72,48.89 38.48,49.66 38.48,52.58 39.5,53.59 42.24,53.59 R26.1
$1N103886: length 3.2
  Top Layer w0.254: R27.1 41.02,57.15 电机信号1.6
$1N103888: length 13.2
  Top Layer w0.254: R28.1 41.73,54.1 39.37,54.1 38.73,54.74 38.73,57.66 37.85,58.55 36.7,58.55 34.92,56.77 电机信号1.2
$1N112323: length 5.7
  Top Layer w0.254: 53.21,40.26 电磁接口2.6
$1N112483: length 5.7
  Top Layer w0.254: 48.13,40.26 电磁接口2.4
$1N112563: length 5.7
  Top Layer w0.254: 45.59,40.26 电磁接口2.3
$1N112723: length 5.7
  Top Layer w0.254: 电磁接口2.1 40.51,40.26

## Copper pours and planes (outline as drawn; the poured copper is in the pictures)
$1N1646 on Top Layer: 151,-13.84 297.31,-13.84 297.31,-91.57 151,-91.57
$1N1646 on Bottom Layer: -97.66,-19.69 47.62,-19.69 47.62,-93.22 -97.66,-93.22
